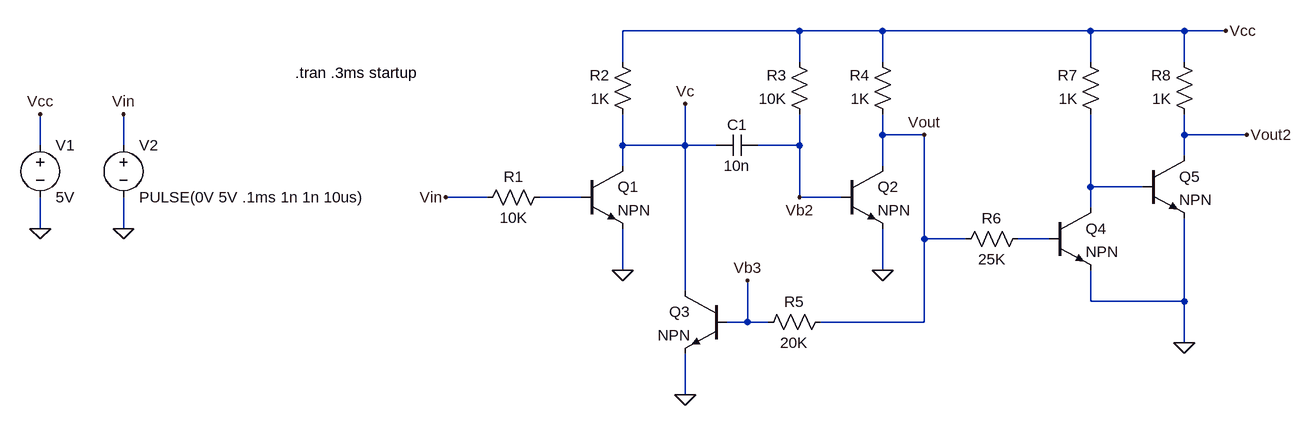
[diagram p0: schematic figure-2.13-pulse-generator-III.asc]
figure-2.13-pulse-generator-III.asc, the LTspice schematic file:
Version 4
SHEET 1 1240 680
WIRE 368 -96 96 -96
WIRE 496 -96 368 -96
WIRE 816 -96 496 -96
WIRE 960 -96 816 -96
WIRE 1024 -96 960 -96
WIRE 96 -48 96 -96
WIRE 368 -48 368 -96
WIRE 496 -48 496 -96
WIRE 816 -48 816 -96
WIRE 960 -48 960 -96
WIRE 496 64 496 32
WIRE 560 64 496 64
WIRE 960 64 960 32
WIRE 1056 64 960 64
WIRE -800 80 -800 32
WIRE -672 80 -672 32
WIRE 96 80 96 32
WIRE 192 80 192 16
WIRE 192 80 96 80
WIRE 240 80 192 80
WIRE 368 80 368 32
WIRE 368 80 304 80
WIRE 960 96 960 64
WIRE 96 112 96 80
WIRE 496 112 496 64
WIRE 816 144 816 32
WIRE 896 144 816 144
WIRE -112 160 -176 160
WIRE 32 160 -32 160
WIRE 368 160 368 80
WIRE 432 160 368 160
WIRE 816 176 816 144
WIRE -800 208 -800 160
WIRE -672 208 -672 160
WIRE 560 224 560 64
WIRE 624 224 560 224
WIRE 752 224 704 224
WIRE 96 272 96 208
WIRE 496 272 496 208
WIRE 192 304 192 80
WIRE 816 320 816 272
WIRE 960 320 960 192
WIRE 960 320 816 320
WIRE 288 352 288 288
WIRE 288 352 256 352
WIRE 320 352 288 352
WIRE 560 352 560 224
WIRE 560 352 400 352
WIRE 960 384 960 320
WIRE 192 464 192 400
FLAG 496 272 0
FLAG 96 272 0
FLAG 1024 -96 Vcc
FLAG -176 160 Vin
FLAG 1056 64 Vout2
FLAG -800 208 0
FLAG -672 208 0
FLAG -672 32 Vin
FLAG -800 32 Vcc
FLAG 368 160 Vb2
FLAG 192 464 0
FLAG 288 288 Vb3
FLAG 192 16 Vc
FLAG 960 384 0
FLAG 560 64 Vout
SYMBOL npn 432 112 R0
SYMATTR InstName Q2
SYMBOL res -16 144 R90
WINDOW 0 0 56 VBottom 2
WINDOW 3 32 56 VTop 2
SYMATTR InstName R1
SYMATTR Value 10K
SYMBOL res 112 48 R180
WINDOW 0 36 76 Left 2
WINDOW 3 36 40 Left 2
SYMATTR InstName R2
SYMATTR Value 1K
SYMBOL res 384 48 R180
WINDOW 0 36 76 Left 2
WINDOW 3 36 40 Left 2
SYMATTR InstName R3
SYMATTR Value 10K
SYMBOL res 512 48 R180
WINDOW 0 36 76 Left 2
WINDOW 3 36 40 Left 2
SYMATTR InstName R4
SYMATTR Value 1K
SYMBOL cap 304 64 R90
WINDOW 0 0 32 VBottom 2
WINDOW 3 32 32 VTop 2
SYMATTR InstName C1
SYMATTR Value 10n
SYMBOL npn 32 112 R0
SYMATTR InstName Q1
SYMBOL voltage -800 64 R0
WINDOW 123 0 0 Left 0
WINDOW 39 0 0 Left 0
SYMATTR InstName V1
SYMATTR Value 5V
SYMBOL voltage -672 64 R0
WINDOW 123 0 0 Left 0
WINDOW 39 0 0 Left 0
SYMATTR InstName V2
SYMATTR Value PULSE(0V 5V .1ms 1n 1n 10us)
SYMBOL npn 256 304 M0
SYMATTR InstName Q3
SYMBOL res 416 336 R90
WINDOW 0 0 56 VBottom 2
WINDOW 3 32 56 VTop 2
SYMATTR InstName R5
SYMATTR Value 20K
SYMBOL npn 752 176 R0
SYMATTR InstName Q4
SYMBOL npn 896 96 R0
SYMATTR InstName Q5
SYMBOL res 720 208 R90
WINDOW 0 0 56 VBottom 2
WINDOW 3 32 56 VTop 2
SYMATTR InstName R6
SYMATTR Value 25K
SYMBOL res 832 48 R180
WINDOW 0 36 76 Left 2
WINDOW 3 36 40 Left 2
SYMATTR InstName R7
SYMATTR Value 1K
SYMBOL res 976 48 R180
WINDOW 0 36 76 Left 2
WINDOW 3 36 40 Left 2
SYMATTR InstName R8
SYMATTR Value 1K
TEXT -408 -32 Left 2 !.tran .3ms startup

The netlist it stands for:
* figure-2.13-pulse-generator-III.asc
Q2 Vout Vb2 0 0 NPN
R1 N002 Vin 10K
R2 Vc Vcc 1K
R3 Vb2 Vcc 10K
R4 Vout Vcc 1K
C1 Vb2 Vc 10n
Q1 Vc N002 0 0 NPN
V1 Vcc 0 5V
V2 Vin 0 PULSE(0V 5V .1ms 1n 1n 10us)
Q3 Vc Vb3 0 0 NPN
R5 Vout Vb3 20K
Q4 N001 N003 0 0 NPN
Q5 Vout2 N001 0 0 NPN
R6 N003 Vout 25K
R7 N001 Vcc 1K
R8 Vout2 Vcc 1K
.model NPN NPN
.model PNP PNP
.lib standard.bjt
.tran .3ms startup
.backanno
.end